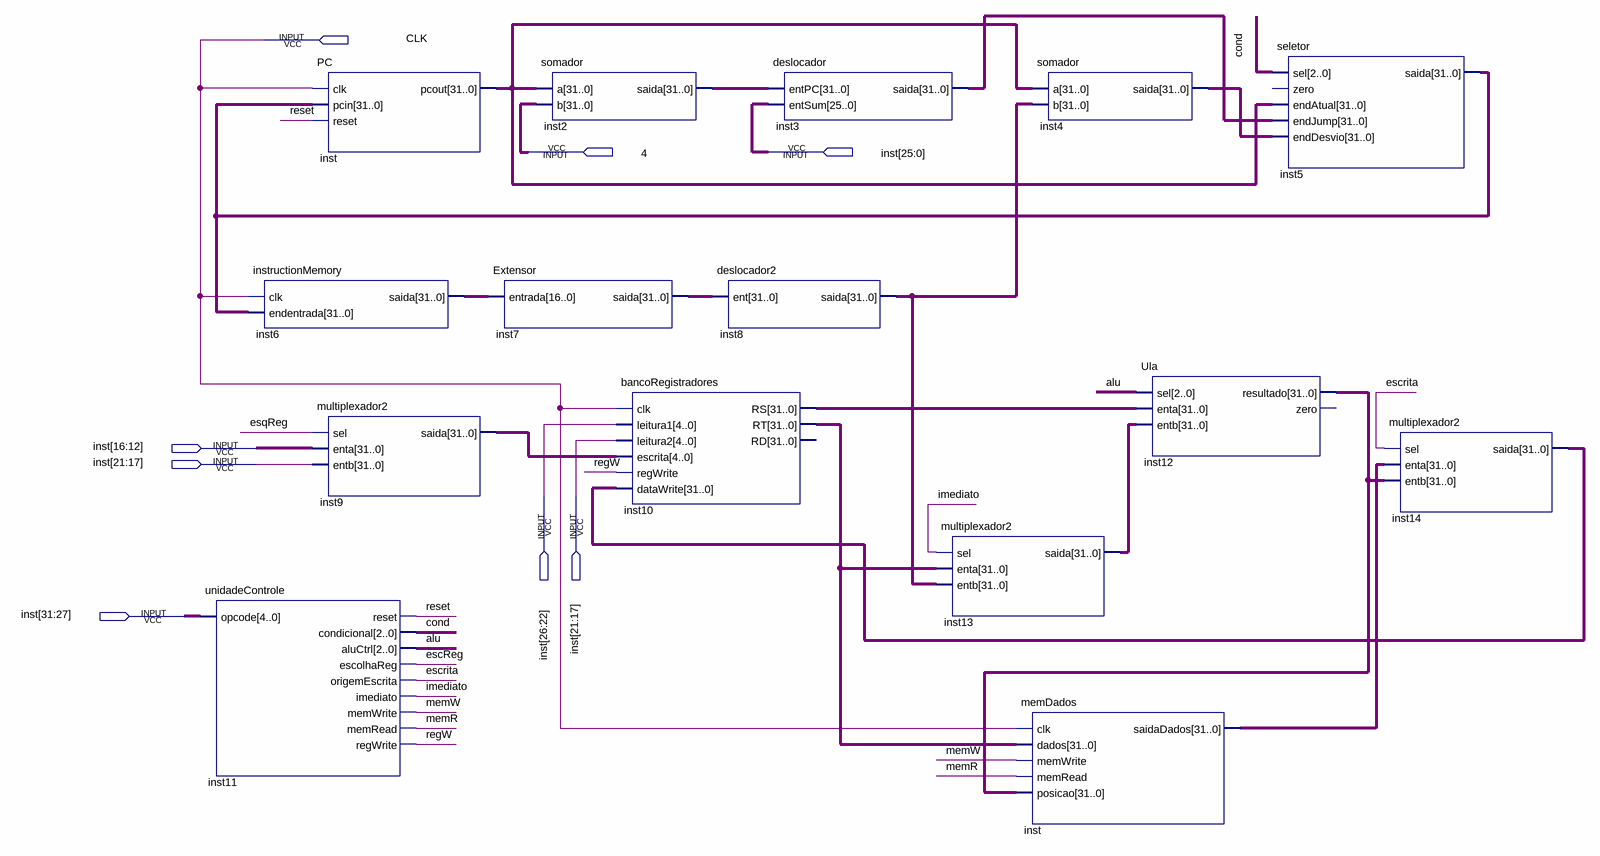
[diagram p0: schematic sheet]
// Quartus schematic esquematico.bdf as structural Verilog: 15 symbols, 8 pins
module esquematico (
  input  CLK,
  input  \4 ,
  input  [31:0] inst
);

  wire alu, cond, escReg, escrita, esqReg, imediato, memR, memW, regW, reset, undriven_2;
  wire [31:0] inst2_saida, inst3_saida, inst4_saida, inst5_saida, inst6_saida, inst7_saida, inst8_saida,
       inst9_saida, inst10_rs, inst10_rt, inst12_resultado, inst13_saida, inst14_saida, inst_pcout,
       inst_saidadados, undriven;

  unidadeControle inst11 (
    .opcode(inst[31:27]), .reset(reset), .condicional(cond), .aluCtrl(alu), .escolhaReg(escReg),
    .origemEscrita(escrita), .imediato(imediato), .memWrite(memW), .memRead(memR), .regWrite(regW));
  instructionMemory inst6 (.clk(CLK), .endentrada(inst5_saida), .saida(inst6_saida));
  PC u_inst (.clk(CLK), .pcin(inst5_saida), .reset(reset), .pcout(inst_pcout));
  multiplexador2 inst9 (.sel(esqReg), .enta(inst[16:12]), .entb({32{undriven_2}}), .saida(inst9_saida));
  Extensor inst7 (.entrada(inst6_saida), .saida(inst7_saida));
  somador inst2 (.a(inst_pcout), .b(undriven), .saida(inst2_saida));
  bancoRegistradores inst10 (
    .clk(CLK), .leitura1(inst[26:22]), .leitura2(inst[21:17]), .escrita(inst9_saida), .regWrite(regW),
    .dataWrite(inst14_saida), .RS(inst10_rs), .RT(inst10_rt));  // open: RD
  deslocador2 inst8 (.ent(inst7_saida), .saida(inst8_saida));
  deslocador inst3 (.entPC(inst2_saida), .entSum(inst[25:0]), .saida(inst3_saida));
  multiplexador2 inst13 (.sel(imediato), .enta(inst10_rt), .entb(inst8_saida), .saida(inst13_saida));
  somador inst4 (.a(inst_pcout), .b(inst8_saida), .saida(inst4_saida));
  memDados u_inst_dup2 (
    .clk(CLK), .dados(inst10_rt), .memWrite(memW), .memRead(memR), .posicao(inst12_resultado),
    .saidaDados(inst_saidadados));
  Ula inst12 (.sel({3{alu}}), .enta(inst10_rs), .entb(inst13_saida), .resultado(inst12_resultado));  // open: zero
  seletor inst5 (
    .sel({3{cond}}), .endAtual(inst_pcout), .endJump(inst3_saida), .endDesvio(inst4_saida),
    .saida(inst5_saida));  // open: zero
  multiplexador2 inst14 (.sel(escrita), .enta(inst_saidadados), .entb(inst12_resultado), .saida(inst14_saida));
endmodule
